# Altium schematic sheet Supply.SchDoc
size A4; SheetNumber: 2; SheetTotal: 3
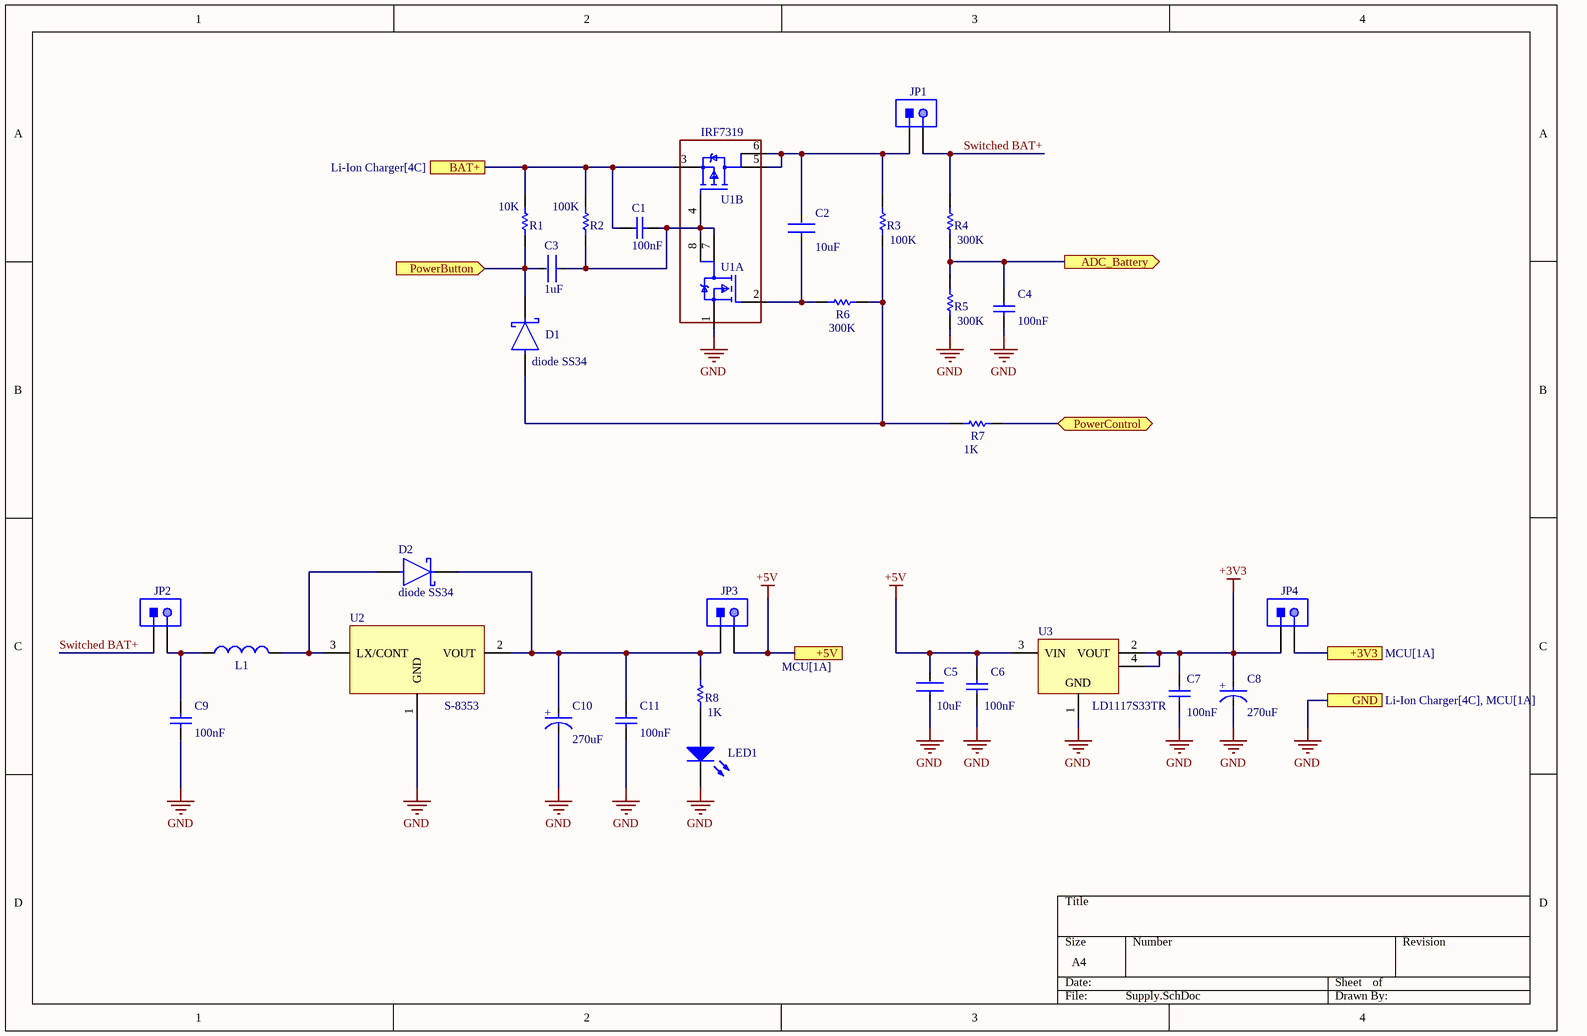
[diagram p0: Supply.SchDoc]

## Parts
C1  value 100nF  [CAPC2013X140X50LL20T25]  (hidden comment: capacitor smd 0805 100nF)
C2  value 10uF  [FP-GRM31-0_2-IPC_B]  (hidden comment: capacitor smd 1206 10uF)
C3  value 1uF  [FP-GRM31-0_2-IPC_B]  (hidden comment: capacitor smd 1206 10uF)
C4  value 100nF  [CAPC2013X140X50LL20T25]  (hidden comment: capacitor smd 0805 100nF)
C5  value 10uF  [FP-GRM31-0_2-IPC_B]  (hidden comment: capacitor smd 1206 10uF)
C6  value 100nF  [CAPC2013X140X50LL20T25]  (hidden comment: capacitor smd 0805 100nF)
C7  value 100nF  [CAPC2013X140X50LL20T25]  (hidden comment: capacitor smd 0805 100nF)
C8  value 270uF  [FP-OS-CON-TH-E12-d_0_6-MFG]  (hidden comment: capacitor 270uF 16V)
C9  value 100nF  [CAPC2013X140X50LL20T25]  (hidden comment: capacitor smd 0805 100nF)
C10  value 270uF  [FP-OS-CON-TH-E12-d_0_6-MFG]  (hidden comment: capacitor 270uF 16V)
C11  value 100nF  [CAPC2013X140X50LL20T25]  (hidden comment: capacitor smd 0805 100nF)
D1  diode SS34  [FP-SS34LWH-MFG]
D2  diode SS34  [FP-SS34LWH-MFG]
JP1  header 2.54 2pin  [61300211121]  (value not drawn)
JP2  header 2.54 2pin  [61300211121]  (value not drawn)
JP3  header 2.54 2pin  [61300211121]  (value not drawn)
JP4  header 2.54 2pin  [61300211121]  (value not drawn)
L1  power inductor 470uH  [WE-PD4-S]  (value not drawn)
LED1  LED green 0805  [0805_A]  (value not drawn)
R1  value 10K  [RESC2013X50X30ML20T20]  (hidden comment: resistor smd 0805 1K)
R2  value 100K  [RESC2013X50X30ML20T20]  (hidden comment: resistor smd 0805 1K)
R3  value 100K  [RESC2013X50X30ML20T20]  (hidden comment: resistor smd 0805 1K)
R4  value 300K  [RESC2013X50X30ML20T20]  (hidden comment: resistor smd 0805 1K)
R5  value 300K  [RESC2013X50X30ML20T20]  (hidden comment: resistor smd 0805 1K)
R6  value 300K  [RESC2013X50X30ML20T20]  (hidden comment: resistor smd 0805 1K)
R7  value 1K  [RESC2013X50X30ML20T20]  (hidden comment: resistor smd 0805 1K)
R8  value 1K  [RESC2013X50X30ML20T20]  (hidden comment: resistor smd 0805 1K)
U1  IRF7319  [FP-PG-DSO-8-IPC_B]  (parts A,B of 2)
U2  S-8353  [SOT89-150P410X160-3N]
U3  LD1117S33TR  [SOT-223_L]

## Ports
+3V3 (see MCU[1A]), +5V (see MCU[1A]), ADC_Battery (out), BAT+ (see Li-Ion Charger[4C]), GND (see Li-Ion Charger[4C], MCU[1A]), PowerButton (in), PowerControl (bidir)

## Nets
+3V3: C7.2 C8.2(A) JP4.1 U3.2(VOUT) U3.4(VOUT)
+5V: C5.2 C6.2 JP3.2 U3.3(VIN) ; port +5V
GND: C4.1 C5.1 C6.1 C7.1 C8.1(C) C9.1 C10.1(C) C11.1 LED1.1(K) R5.1 U1.1(S1) U2.1(GND) U3.1(GND) ; port GND
+3V3: JP4.2 ; port +3V3  [a separate net that carries the same name]
ADC_Battery: C4.2 R4.1 R5.2 ; port ADC_Battery
BAT+: C1.2 R1.2 R2.2 U1.3(S2) ; port BAT+
PowerButton: C3.2 D1.1(C) R1.1 ; port PowerButton
PowerControl: R7.2 ; port PowerControl
Switched BAT+: JP1.2 JP2.1 R4.2
NetC1_1: C1.1 C3.1 R2.1 U1.4(G2) U1.7(D1) U1.8(D1)
NetC2_1: C2.1 R6.1 U1.2(G1)
NetC2_2: C2.2 JP1.1 R3.2 U1.5(D2) U1.6(D2)
NetC9_2: C9.2 JP2.2 L1.1
NetC10_2: C10.2(A) C11.2 D2.1(C) JP3.1 R8.2 U2.2(VOUT)
NetD1_2: D1.2(A) R3.1 R6.2 R7.1
NetD2_2: D2.2(A) L1.2 U2.3(LX/CONT)
NetLED1_2: LED1.2(A) R8.1

## Notes on the sheet
- (in symbol CMP-001-00087-1) +

## Library data of the parts
C1 C4 C6 C7 C9 C11 = CMP-001-00085-1: Cap Ceramic 0.1uF 50V X7R 10% Pad SMD 0805 FlexiTerm 125C Automotive T/R
C2 C3 C5 = CMP-001-00086-1: Multilayer Ceramic Capacitors MLCC - SMD/SMT 1206 10uF 50volt X5R +/-10%
C8 C10 = CMP-001-00087-1: Cap Aluminum Polymer 270uF 16VDC 20% (8 X 12mm) Radial 3.5mm 0.011 Ohm 5000mA 5000h 105C T/R
D1 D2 = CMP-004-00032-2: Rectifier Diode Schottky 40V 3A Automotive 2-Pin SOD-123W T/R
JP1-JP4 = CMP-002-00072-1: CONN HEADER 2 POS 2.54
L1 = CMP-006-00022-2: Surface Mount Power Inductor, We-Pd4 Series, 470 H, 20%, Unshielded, 6.8 Ohm, 160 Ma Rohs Compliant: Yes
LED1 = CMP-007-00036-1: Led, Green, 520 Nm, 3.2 V, 30 Ma, 450 Mcd Rohs Compliant: Yes
R1-R8 = CMP-009-00179-1: Res Thick Film 0805 1K Ohm 1% 1/8W ±100ppm/°C Molded SMD Paper T/R
U1 = CMP-013-00034-1: IRF7309PBF Dual N/P-channel MOSFET Transistor; 3 A; 4 A; 30 V; 8-Pin SOIC
U2 = CMP-019-00051-1
U3 = CMP-019-00050-1: IC REG LDO 3.3V 0.8A SOT223